# EasyEDA schematic VocaTap- rev 1.0.json
TITLE: Sheet_1; REV: 1.0; Date: 2026-05-07; Sheet: 1/1; Company: Your Company
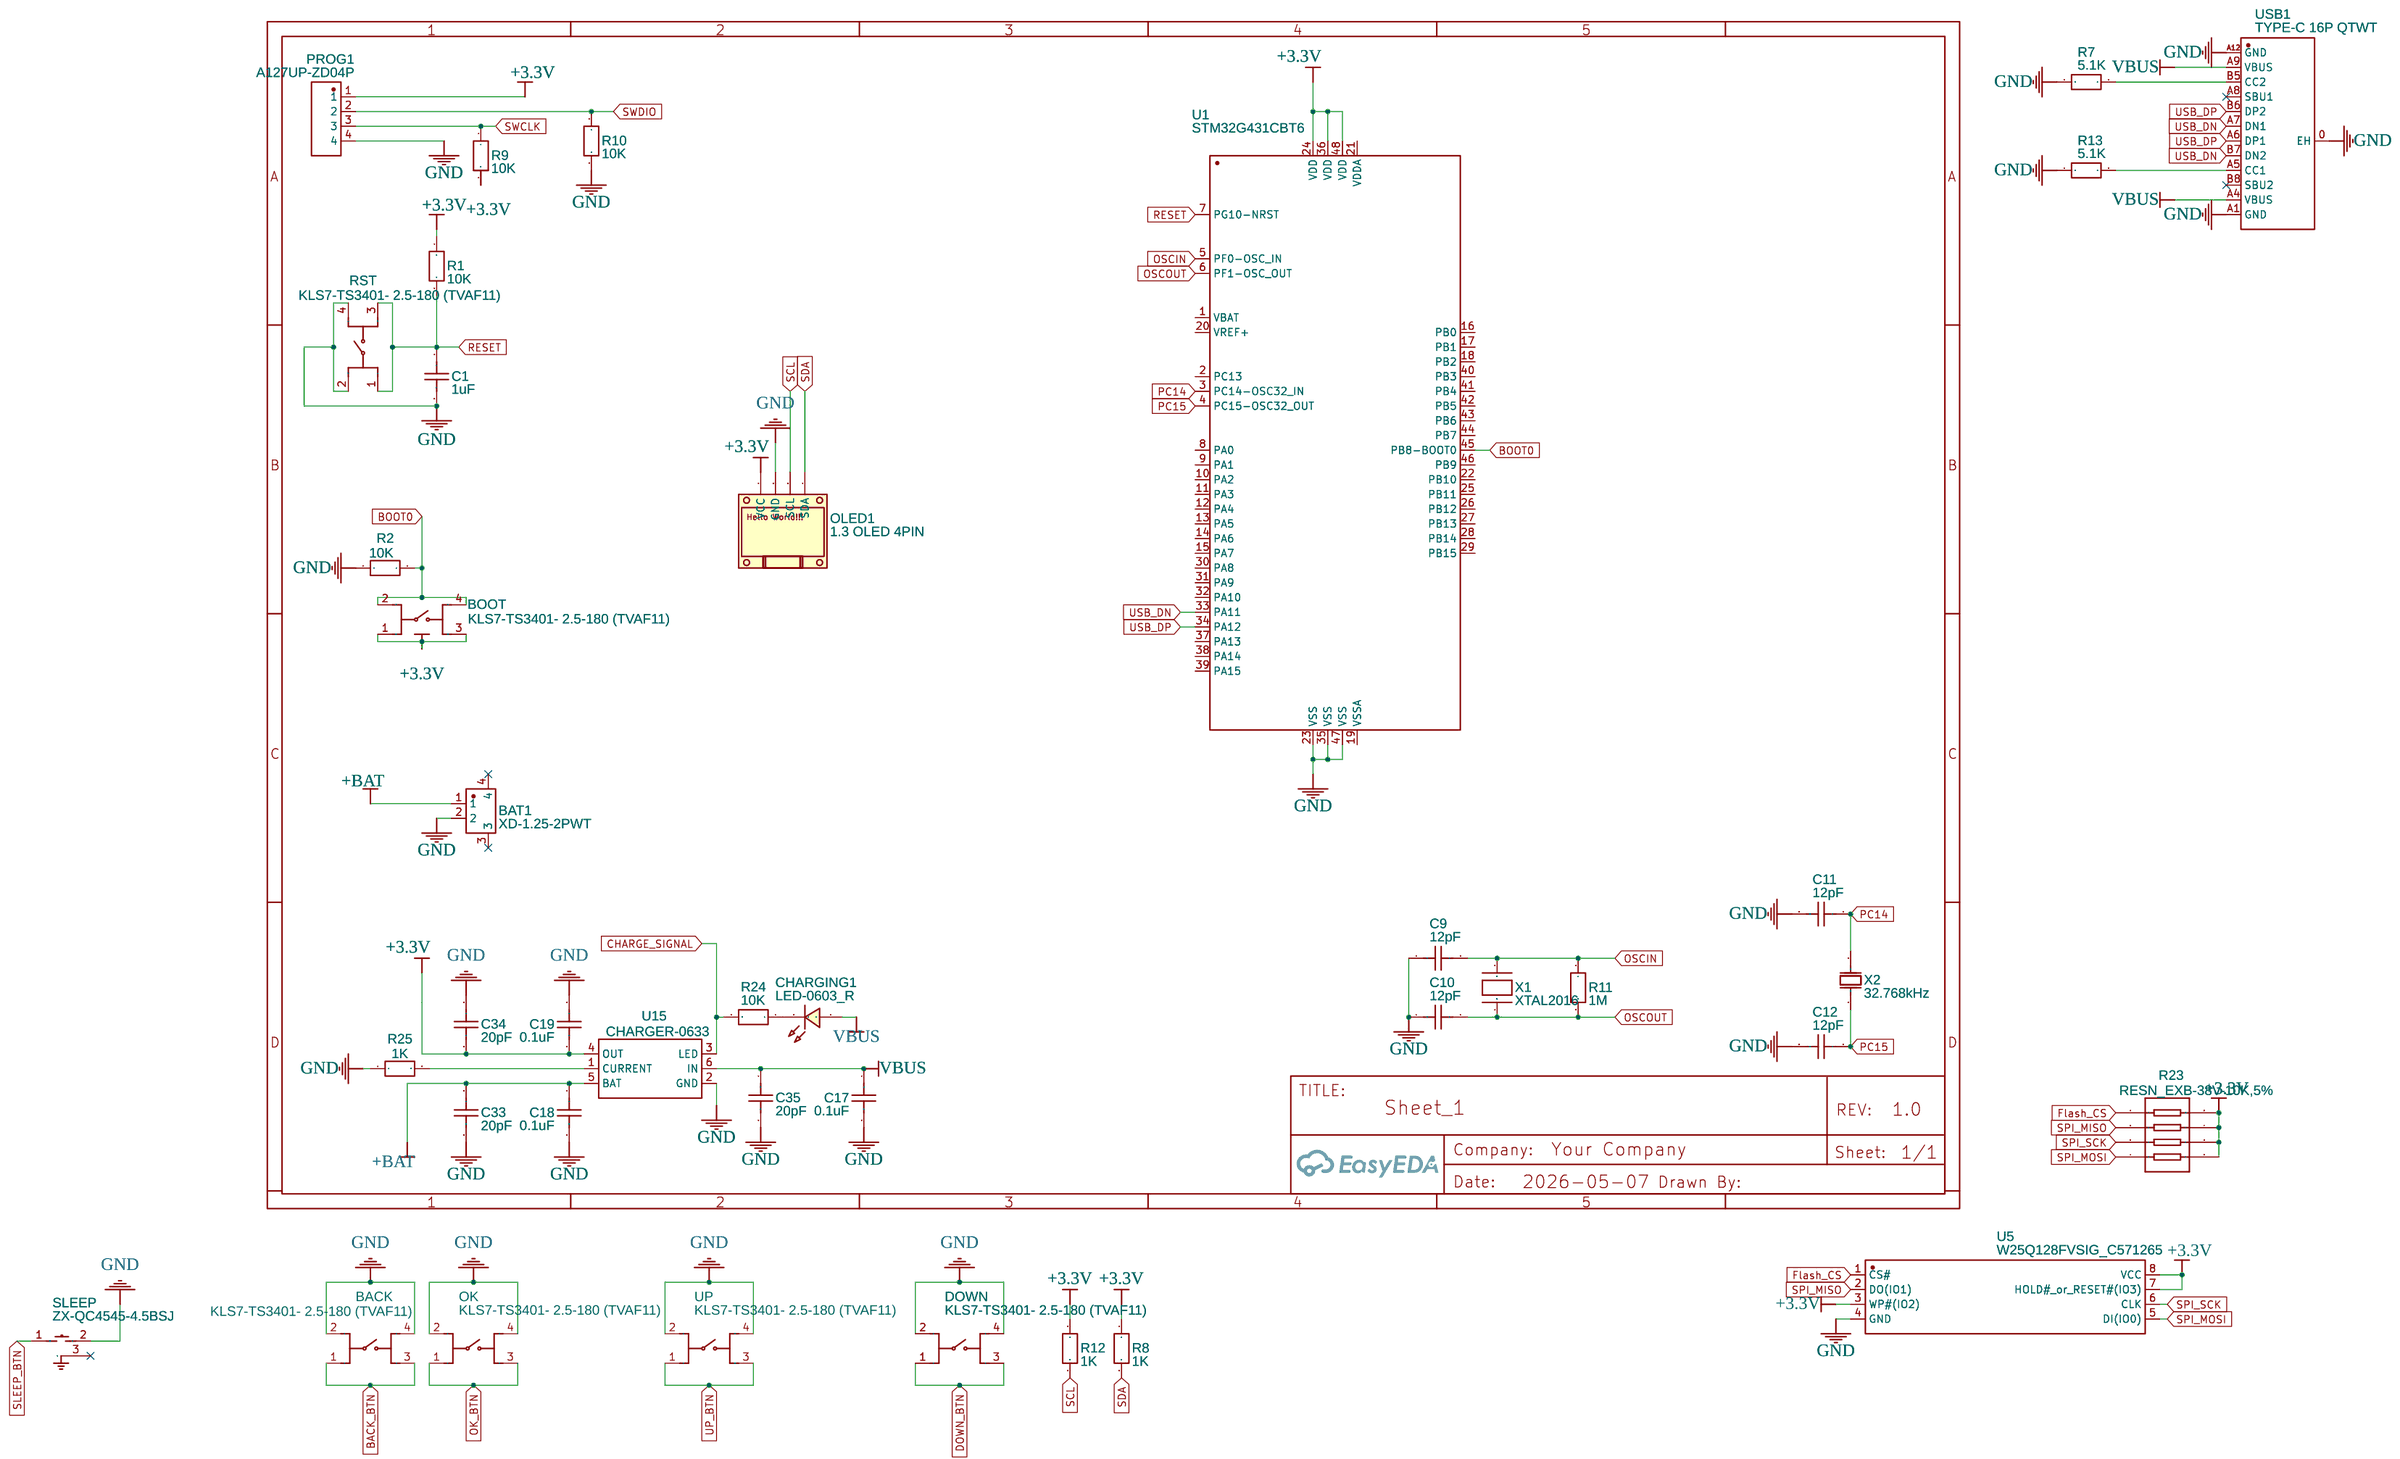
[diagram p0: schematic sheet]

## Parts
BACK  KLS7-TS3401- 2.5-180 (TVAF11)  [KLS7-TS3401- 2.5-180 (TVAF11)]
BAT1  XD-1.25-2PWT  [CONN-SMD_2P-P1.25-XUNDA-1.25-2PWT]
BOOT  KLS7-TS3401- 2.5-180 (TVAF11)  [KLS7-TS3401- 2.5-180 (TVAF11)]
C1  1uF  [C0603]
C9  12pF  [C0603]
C10  12pF  [C0603]
C11  12pF  [C0603]
C12  12pF  [C0603]
C17  0.1uF  [C0603]
C18  0.1uF  [C0603]
C19  0.1uF  [C0603]
C33  20pF  [C0603]
C34  20pF  [C0603]
C35  20pF  [C0603]
CHARGING1  LED-0603_R  [LED0603_RED]
DOWN  KLS7-TS3401- 2.5-180 (TVAF11)  [KLS7-TS3401- 2.5-180 (TVAF11)]
OK  KLS7-TS3401- 2.5-180 (TVAF11)  [KLS7-TS3401- 2.5-180 (TVAF11)]
OLED1  1.3 OLED 4PIN  [1.3OLED_4P]
PROG1  A127UP-ZD04P  [HDR-TH_4P-P1.27-V-M]
R1  10K  [R0603]
R2  10K  [R0603]
R7  5.1K  [R0603]
R8  1K  [R0603]
R9  10K  [R0603]
R10  10K  [R0603]
R11  1M  [R0603]
R12  1K  [R0603]
R13  5.1K  [R0603]
R23  RESN_EXB-38V-10K,5%  [RES-ARRAY-SMD_0603-8P-L3.2-W1.6-BL]
R24  10K  [R0603]
R25  1K  [R0603]
RST  KLS7-TS3401- 2.5-180 (TVAF11)  [KLS7-TS3401- 2.5-180 (TVAF11)]
SLEEP  ZX-QC4545-4.5BSJ  [KEY-TH_3P-L4.5-W4.3-P3.00]
U1  STM32G431CBT6  [LQFP-48_L7.0-W7.0-P0.50-LS9.0-BL]
U5  W25Q128FVSIG_C571265  [SOIC-8_L5.3-W5.3-P1.27-LS7.9-BL]
U15  CHARGER-0633  [TSOT-23-6_L2.9-W1.6-P0.95-LS2.8-BL]
UP  KLS7-TS3401- 2.5-180 (TVAF11)  [KLS7-TS3401- 2.5-180 (TVAF11)]
USB1  TYPE-C 16P QTWT  [USB-TYPE-C-SMD_TYPE-C-16P-QTWT]
X1  XTAL2016  [2016_XTAL]
X2  32.768kHz  [OSC-SMD_L3.2-W1.5]

## Library data of the parts
BACK BOOT DOWN OK RST UP = KLS7-TS3401- 2.5-180 (TVAF11): link: https://www.chipdip.ru/product/kls7-ts3401-2-5-180-tvaf11; Contributor: seldomorama
BAT1 = XD-1.25-2PWT: Supplier: LCSC; Supplier Part: C17700350; Manufacturer: XUNDA(讯答); JLCPCB Part Class: Extended Part; Contributor: lcsc; link: https://lcsc.com/eda_search?q=C17700350&%26type=1&ref=editor
C1 C9-C12 C17-C19 C33-C35 = C_0603_US: Contributor: LCEDA_Lib
CHARGING1 = LED-0603_R: Manufacturer: EVERLIGHT(台湾亿光); Manufacturer Part: 19-217/R6C-AL1M2VY/3T; Supplier Part: C72044; Supplier: LCSC; Contributor: LCEDA_01
OLED1 = 1.3 OLED 4PIN: Contributor: parcoyeung
PROG1 = A127UP-ZD04P: Supplier: LCSC; Supplier Part: C41366759; Manufacturer: BXCONN(宝讯); JLCPCB Part Class: Extended Part; Contributor: lcsc; link: https://lcsc.com/eda_search?q=C41366759&%26type=1&ref=editor; 3DModel: HDR-TH_4P-P1.27-M-LI-1X4P
R1 R2 R7-R13 R24 R25 = R_0603_EU: Contributor: LCEDA_Lib
R23 = RESN_EXB-38V-22R,5%: Contributor: lcsc; Supplier: LCSC; Supplier Part: C9900011211; Manufacturer: null; JLCPCB Part Class: Extended Part; link: https://lcsc.com/eda_search?q=C9900011211&%26type=1&ref=editor; 3DModel: R0603-8P_L3.2-W1.6-H0.6
SLEEP = ZX-QC4545-4.5BSJ: Supplier: LCSC; Supplier Part: C7470179; Manufacturer: Megastar(兆星); link: https://lcsc.com/eda_search?q=C7470179&%26type=1&ref=editor; Contributor: lcsc; JLCPCB Part Class: Extended Part; 3DModel: KEY-TH_3P-L4.5-W4.3-H4.5-P3.00
U1 = STM32G431CBT6: Contributor: LCSC; Supplier: LCSC; Supplier Part: C529355; Manufacturer: ST(意法半导体); JLCPCB Part Class: Extended Part; link: https://lcsc.com/eda_search?q=C529355&%26type=1&ref=editor
U5 = W25Q128FVSIG_C571265: Contributor: LCSC; Supplier: LCSC; Supplier Part: C571265; Manufacturer: WINBOND(华邦); Manufacturer Part: W25Q128FVSIG; JLCPCB Part Class: Extended Part; link: https://lcsc.com/eda_search?q=C571265&%26type=1&ref=editor
U15 = TP4067-3.70V-SOT26-R: Contributor: lcsc; Supplier: LCSC; Supplier Part: C5447151; Manufacturer: TOPPOWER(南京拓微); JLCPCB Part Class: Extended Part; link: https://lcsc.com/eda_search?q=C5447151&%26type=1&ref=editor
USB1 = TYPE-C 16P QTWT: Contributor: lcsc; Supplier: LCSC; Supplier Part: C5187472; Manufacturer: SHOU HAN(首韩); JLCPCB Part Class: Extended Part; link: https://lcsc.com/eda_search?q=C5187472&%26type=1&ref=editor
X1 = XTAL2016: Contributor: gianni2009
X2 = NX3215SA-32.768KHZ(STD-MUA-8): Contributor: LCSC; Supplier: LCSC; Supplier Part: C156245; Manufacturer: NDK; Manufacturer Part: NX3215SA-32.768K-STD-MUA-8; JLCPCB Part Class: Extended Part; link: https://lcsc.com/eda_search?q=C156245&%26type=1&ref=editor

## Nets
+3.3V: BOOT.1 BOOT.3 C19.2 C34.2 OLED1.1(VCC) PROG1.1 R1.1 R8.1 R9.2 R12.1 R23.5 R23.6 R23.7 R23.8 U1.24(VDD) U1.36(VDD) U1.48(VDD) U5.3(WP#(IO2)) U5.7(HOLD# or RESET#(IO3)) U5.8(VCC) U15.4(OUT)
GND: BACK.2 BACK.4 BAT1.2 C1.2 C9.1 C10.1 C11.1 C12.1 C17.2 C18.2 C19.1 C33.2 C34.1 C35.2 DOWN.2 DOWN.4 OK.2 OK.4 OLED1.2(GND) PROG1.4 R2.1 R7.1 R10.2 R13.1 R25.1 RST.2 RST.4 SLEEP.2 U1.23(VSS) U1.35(VSS) U1.47(VSS) U5.4(GND) U15.2(GND) UP.2 UP.4 USB1.0(EH) USB1.A1(GND) USB1.A12(GND)
VBUS: C17.1 C35.1 CHARGING1.1 U15.6(IN) USB1.A4(VBUS) USB1.A9(VBUS)
+BAT: BAT1.1 C18.1 C33.1 U15.5(BAT)
BACK_BTN: BACK.1 BACK.3
BOOT0: BOOT.2 BOOT.4 R2.2 U1.45(PB8-BOOT0)
CHARGE_SIGNAL: R24.2 U15.3(LED)
DOWN_BTN: DOWN.1 DOWN.3
Flash_CS: R23.1 U5.1(CS#)
OK_BTN: OK.1 OK.3
OSCIN: C9.2 R11.1 U1.5(PF0-OSC_IN) X1.1(P$1)
OSCOUT: C10.2 R11.2 U1.6(PF1-OSC_OUT) X1.3(P$2)
PC14: C11.2 U1.3(PC14-OSC32_IN) X2.1(OSC1)
PC15: C12.2 U1.4(PC15-OSC32_OUT) X2.2(OSC2)
RESET: C1.1 R1.2 RST.1 RST.3 U1.7(PG10-NRST)
SCL: OLED1.3(SCL) R12.2
SDA: OLED1.4(SDA) R8.2
SLEEP_BTN: SLEEP.1
SPI_MISO: R23.2 U5.2(DO(IO1))
SPI_MOSI: R23.4 U5.5(DI(IO0))
SPI_SCK: R23.3 U5.6(CLK)
SWCLK: PROG1.3 R9.1
SWDIO: PROG1.2 R10.1
UP_BTN: UP.1 UP.3
USB_DN: U1.33(PA11) USB1.A7(DN1) USB1.B7(DN2)
USB_DP: U1.34(PA12) USB1.A6(DP1) USB1.B6(DP2)
Net-(CHARGING1-2): CHARGING1.2 R24.1
Net-(R7-2): R7.2 USB1.B5(CC2)
Net-(R13-2): R13.2 USB1.A5(CC1)
Net-(R25-2): R25.2 U15.1(CURRENT)

Not connected (* = marked no-connect by the designer): BAT1 3* 4*; SLEEP 3*; U1 1(VBAT) 2(PC13) 8(PA0) 9(PA1) 10(PA2) 11(PA3) 12(PA4) 13(PA5) 14(PA6) 15(PA7) 16(PB0) 17(PB1) 18(PB2) 19(VSSA) 20(VREF+) 21(VDDA) 22(PB10) 25(PB11) 26(PB12) 27(PB13) 28(PB14) 29(PB15) 30(PA8) 31(PA9) 32(PA10) 37(PA13) 38(PA14) 39(PA15) 40(PB3) 41(PB4) 42(PB5) 43(PB6) 44(PB7) 46(PB9); USB1 A8(SBU1)* B8(SBU2)*
